# EAGLE design FY - OPTO_BOARD_1_SWBOTTOP (EAGLE 6.0)
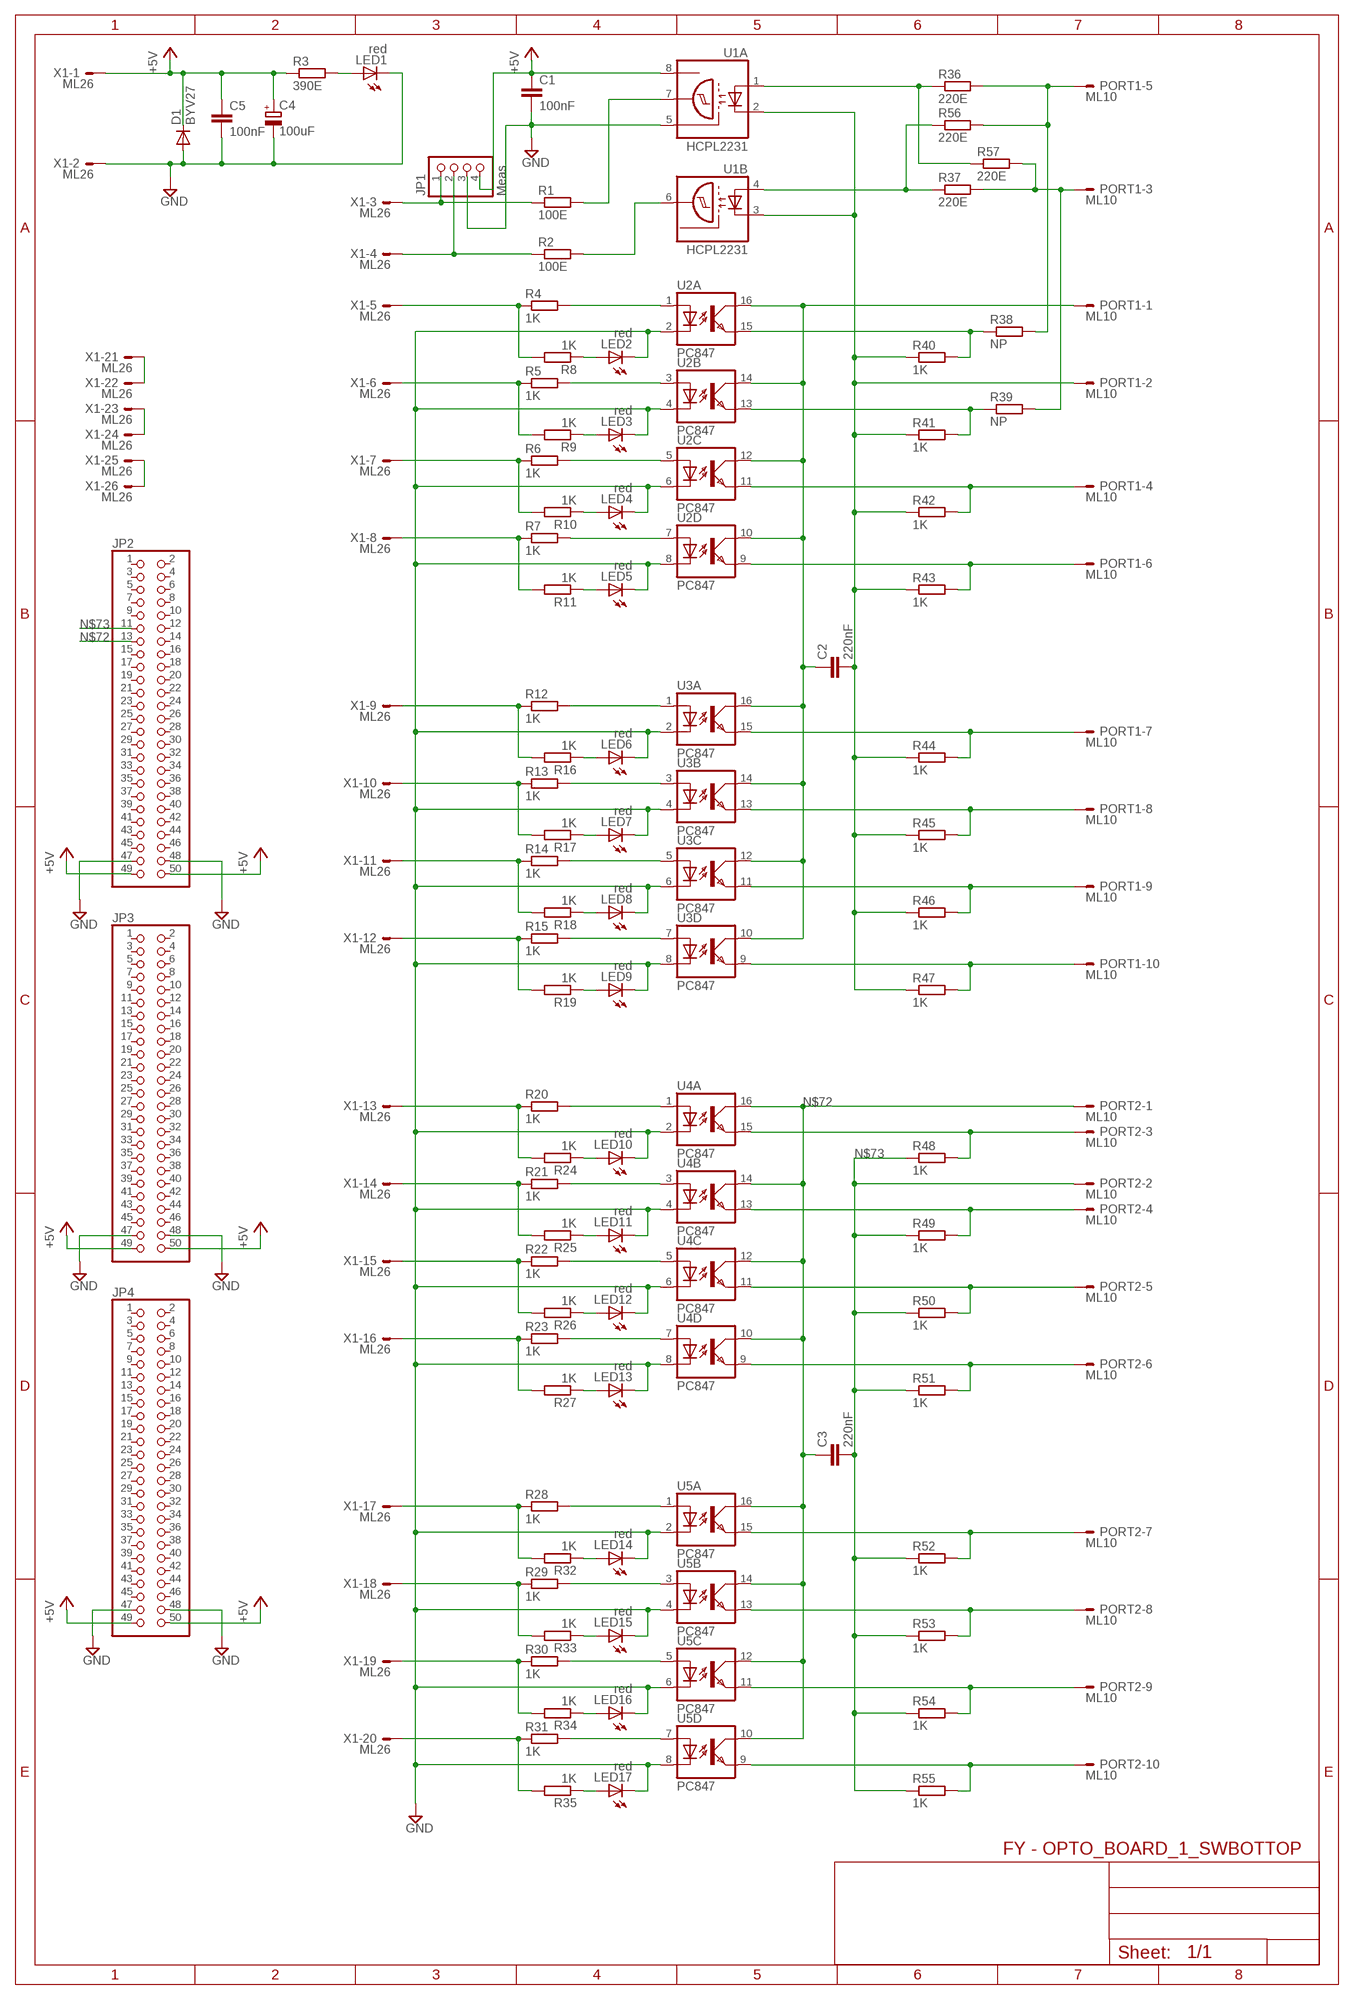
[diagram p0: schematic, sheet 1]

## Parts
C1  100nF  C-EU050-025X075  [C050-025X075]
C2  220nF  C-EU050-025X075  [C050-025X075]
C3  220nF  C-EU050-025X075  [C050-025X075]
C4  100uF  CPOL-EUE5-8.5  [E5-8,5]
C5  100nF  C-EU050-025X075  [C050-025X075]
D1  BYV27  [SOD57-10]
JP1  Meas  PINHD-1X4  [1X04]
JP2  PINHD-2X25  [2X25]
JP3  PINHD-2X25  [2X25]
JP4  PINHD-2X25  [2X25]
LED1  red  LED3MM  [LED3MM]
LED2  red  LED3MM  [LED3MM]
LED3  red  LED3MM  [LED3MM]
LED4  red  LED3MM  [LED3MM]
LED5  red  LED3MM  [LED3MM]
LED6  red  LED3MM  [LED3MM]
LED7  red  LED3MM  [LED3MM]
LED8  red  LED3MM  [LED3MM]
LED9  red  LED3MM  [LED3MM]
LED10  red  LED3MM  [LED3MM]
LED11  red  LED3MM  [LED3MM]
LED12  red  LED3MM  [LED3MM]
LED13  red  LED3MM  [LED3MM]
LED14  red  LED3MM  [LED3MM]
LED15  red  LED3MM  [LED3MM]
LED16  red  LED3MM  [LED3MM]
LED17  red  LED3MM  [LED3MM]
PORT1  ML10  ML10E  [ML10]
PORT2  ML10  ML10E  [ML10]
R1  100E  R-EU_0207/10  [0207/10]
R2  100E  R-EU_0207/10  [0207/10]
R3  390E  R-EU_0207/10  [0207/10]
R4  1K  R-EU_0207/10  [0207/10]
R5  1K  R-EU_0207/10  [0207/10]
R6  1K  R-EU_0207/10  [0207/10]
R7  1K  R-EU_0207/10  [0207/10]
R8  1K  R-EU_0207/10  [0207/10]
R9  1K  R-EU_0207/10  [0207/10]
R10  1K  R-EU_0207/10  [0207/10]
R11  1K  R-EU_0207/10  [0207/10]
R12  1K  R-EU_0207/10  [0207/10]
R13  1K  R-EU_0207/10  [0207/10]
R14  1K  R-EU_0207/10  [0207/10]
R15  1K  R-EU_0207/10  [0207/10]
R16  1K  R-EU_0207/10  [0207/10]
R17  1K  R-EU_0207/10  [0207/10]
R18  1K  R-EU_0207/10  [0207/10]
R19  1K  R-EU_0207/10  [0207/10]
R20  1K  R-EU_0207/10  [0207/10]
R21  1K  R-EU_0207/10  [0207/10]
R22  1K  R-EU_0207/10  [0207/10]
R23  1K  R-EU_0207/10  [0207/10]
R24  1K  R-EU_0207/10  [0207/10]
R25  1K  R-EU_0207/10  [0207/10]
R26  1K  R-EU_0207/10  [0207/10]
R27  1K  R-EU_0207/10  [0207/10]
R28  1K  R-EU_0207/10  [0207/10]
R29  1K  R-EU_0207/10  [0207/10]
R30  1K  R-EU_0207/10  [0207/10]
R31  1K  R-EU_0207/10  [0207/10]
R32  1K  R-EU_0207/10  [0207/10]
R33  1K  R-EU_0207/10  [0207/10]
R34  1K  R-EU_0207/10  [0207/10]
R35  1K  R-EU_0207/10  [0207/10]
R36  220E  R-EU_0207/10  [0207/10]
R37  220E  R-EU_0207/10  [0207/10]
R38  NP  R-EU_0207/10  [0207/10]
R39  NP  R-EU_0207/10  [0207/10]
R40  1K  R-EU_0207/10  [0207/10]
R41  1K  R-EU_0207/10  [0207/10]
R42  1K  R-EU_0207/10  [0207/10]
R43  1K  R-EU_0207/10  [0207/10]
R44  1K  R-EU_0207/10  [0207/10]
R45  1K  R-EU_0207/10  [0207/10]
R46  1K  R-EU_0207/10  [0207/10]
R47  1K  R-EU_0207/10  [0207/10]
R48  1K  R-EU_0207/10  [0207/10]
R49  1K  R-EU_0207/10  [0207/10]
R50  1K  R-EU_0207/10  [0207/10]
R51  1K  R-EU_0207/10  [0207/10]
R52  1K  R-EU_0207/10  [0207/10]
R53  1K  R-EU_0207/10  [0207/10]
R54  1K  R-EU_0207/10  [0207/10]
R55  1K  R-EU_0207/10  [0207/10]
R56  220E  R-EU_0207/10  [0207/10]
R57  220E  R-EU_0207/10  [0207/10]
U1  HCPL2231  [DIL08]
U2  PC847  [DIL16]
U3  PC847  [DIL16]
U4  PC847  [DIL16]
U5  PC847  [DIL16]
X1  ML26  ML26E  [ML26]

## Nets
+5V [Power]: C1.1 C4.+ C5.1 D1.C JP1.4 JP2.49 JP2.50 JP3.49 JP3.50 JP4.49 JP4.50 R3.1 U1.8(A:VCC) X1.1
GND [Power]: C1.2 C4.- C5.2 D1.A JP1.3 JP2.47 JP2.48 JP3.47 JP3.48 JP4.47 JP4.48 LED1.K(C) LED2.K(C) LED3.K(C) LED4.K(C) LED5.K(C) LED6.K(C) LED7.K(C) LED8.K(C) LED9.K(C) LED10.K(C) LED11.K(C) LED12.K(C) LED13.K(C) LED14.K(C) LED15.K(C) LED16.K(C) LED17.K(C) U1.5(A:GND) U2.2(A:C) U2.4(B:C) U2.6(C:C) U2.8(D:C) U3.2(A:C) U3.4(B:C) U3.6(C:C) U3.8(D:C) U4.2(A:C) U4.4(B:C) U4.6(C:C) U4.8(D:C) U5.2(A:C) U5.4(B:C) U5.6(C:C) U5.8(D:C) X1.2
N$1: R1.2 U1.7(A:OUT)
N$2: LED1.A R3.2
N$3: R2.2 U1.6(B:OUT)
N$4: JP1.1 R1.1 X1.3
N$5: JP1.2 R2.1 X1.4
N$6: R4.2 U2.1(A:A)
N$7: R5.2 U2.3(B:A)
N$8: R6.2 U2.5(C:A)
N$9: R7.2 U2.7(D:A)
N$10: R4.1 R8.2 X1.5
N$11: LED2.A R8.1
N$12: LED3.A R9.1
N$13: LED4.A R10.1
N$14: LED5.A R11.1
N$15: R5.1 R9.2 X1.6
N$16: R6.1 R10.2 X1.7
N$17: R7.1 R11.2 X1.8
N$18: PORT1.6 R43.2 U2.9(D:EMIT)
N$19: PORT1.4 R42.2 U2.11(C:EMIT)
N$20: R39.1 R41.2 U2.13(B:EMIT)
N$21: R38.1 R40.2 U2.15(A:EMIT)
N$22: R12.2 U3.1(A:A)
N$23: R12.1 R16.2 X1.9
N$24 [Power]: C2.1 PORT1.1 U2.10(D:COL) U2.12(C:COL) U2.14(B:COL) U2.16(A:COL) U3.10(D:COL) U3.12(C:COL) U3.14(B:COL) U3.16(A:COL)
N$25: R13.2 U3.3(B:A)
N$26: R13.1 R17.2 X1.10
N$27: PORT1.3 R37.2 R39.2 R57.2
N$28: R14.2 U3.5(C:A)
N$29: R14.1 R18.2 X1.11
N$30: PORT1.7 R44.2 U3.15(A:EMIT)
N$31: R15.2 U3.7(D:A)
N$32: R15.1 R19.2 X1.12
N$33: R36.1 R57.1 U1.1(A:A)
N$34: LED6.A R16.1
N$35: LED7.A R17.1
N$36: LED8.A R18.1
N$37: LED9.A R19.1
N$38: R20.2 U4.1(A:A)
N$39: R20.1 R24.2 X1.13
N$40: R37.1 R56.1 U1.4(B:A)
N$41: LED10.A R24.1
N$42: R21.2 U4.3(B:A)
N$43: R21.1 R25.2 X1.14
N$44: PORT1.5 R36.2 R38.2 R56.2
N$45: R22.2 U4.5(C:A)
N$46: R22.1 R26.2 X1.15
N$47: PORT1.8 R45.2 U3.13(B:EMIT)
N$48: R23.2 U4.7(D:A)
N$49: R23.1 R27.2 X1.16
N$50: PORT1.9 R46.2 U3.11(C:EMIT)
N$51: LED13.A R27.1
N$52: LED12.A R26.1
N$53: LED11.A R25.1
N$54: R28.2 U5.1(A:A)
N$55: R28.1 R32.2 X1.17
N$56: PORT1.10 R47.2 U3.9(D:EMIT)
N$57: R29.2 U5.3(B:A)
N$58: R29.1 R33.2 X1.18
N$59 [Power]: C2.2 PORT1.2 R40.1 R41.1 R42.1 R43.1 R44.1 R45.1 R46.1 R47.1 U1.2(A:C) U1.3(B:C)
N$60: R30.2 U5.5(C:A)
N$61: R30.1 R34.2 X1.19
N$62: R31.2 U5.7(D:A)
N$63: R31.1 R35.2 X1.20
N$64: PORT2.3 R48.2 U4.15(A:EMIT)
N$65: LED14.A R32.1
N$66: LED15.A R33.1
N$67: LED16.A R34.1
N$68: PORT2.4 R49.2 U4.13(B:EMIT)
N$69: LED17.A R35.1
N$70: PORT2.5 R50.2 U4.11(C:EMIT)
N$71: PORT2.6 R51.2 U4.9(D:EMIT)
N$72 [Power]: C3.1 JP2.13 PORT2.1 U4.10(D:COL) U4.12(C:COL) U4.14(B:COL) U4.16(A:COL) U5.10(D:COL) U5.12(C:COL) U5.14(B:COL) U5.16(A:COL)
N$73 [Power]: C3.2 JP2.11 PORT2.2 R48.1 R49.1 R50.1 R51.1 R52.1 R53.1 R54.1 R55.1
N$74: PORT2.7 R52.2 U5.15(A:EMIT)
N$75: PORT2.8 R53.2 U5.13(B:EMIT)
N$76: PORT2.9 R54.2 U5.11(C:EMIT)
N$77: PORT2.10 R55.2 U5.9(D:EMIT)
N$78: X1.21 X1.22
N$79: X1.25 X1.26
N$155: X1.23 X1.24
Unconnected: JP2.1 JP2.2 JP2.3 JP2.4 JP2.5 JP2.6 JP2.7 JP2.8 JP2.9 JP2.10 JP2.12 JP2.14 JP2.15 JP2.16 JP2.17 JP2.18 JP2.19 JP2.20 JP2.21 JP2.22 JP2.23 JP2.24 JP2.25 JP2.26 JP2.27 JP2.28 JP2.29 JP2.30 JP2.31 JP2.32 JP2.33 JP2.34 JP2.35 JP2.36 JP2.37 JP2.38 JP2.39 JP2.40 JP2.41 JP2.42 JP2.43 JP2.44 JP2.45 JP2.46 JP3.1 JP3.2 JP3.3 JP3.4 JP3.5 JP3.6 JP3.7 JP3.8 JP3.9 JP3.10 JP3.11 JP3.12 JP3.13 JP3.14 JP3.15 JP3.16 JP3.17 JP3.18 JP3.19 JP3.20 JP3.21 JP3.22 JP3.23 JP3.24 JP3.25 JP3.26 JP3.27 JP3.28 JP3.29 JP3.30 JP3.31 JP3.32 JP3.33 JP3.34 JP3.35 JP3.36 JP3.37 JP3.38 JP3.39 JP3.40 JP3.41 JP3.42 JP3.43 JP3.44 JP3.45 JP3.46 JP4.1 JP4.2 JP4.3 JP4.4 JP4.5 JP4.6 JP4.7 JP4.8 JP4.9 JP4.10 JP4.11 JP4.12 JP4.13 JP4.14 JP4.15 JP4.16 JP4.17 JP4.18 JP4.19 JP4.20 JP4.21 JP4.22 JP4.23 JP4.24 JP4.25 JP4.26 JP4.27 JP4.28 JP4.29 JP4.30 JP4.31 JP4.32 JP4.33 JP4.34 JP4.35 JP4.36 JP4.37 JP4.38 JP4.39 JP4.40 JP4.41 JP4.42 JP4.43 JP4.44 JP4.45 JP4.46

## Library data of the parts
C1-C3 C5 = rcl:C-EU: CAPACITOR, European symbol
C4 = rcl:CPOL-EU: POLARIZED CAPACITOR, European symbol
D1 = diode:BYV27: DIODE ultra fast
JP1 = pinhead:PINHD-1X4: PIN HEADER
JP2-JP4 = pinhead:PINHD-2X25: PIN HEADER
LED1-LED17 = led:LED: LED OSRAM: - CHIPLED LG R971, LG N971, LY N971, LG Q971, LY Q971, LO R971, LY R971 LH N974, LH R974 LS Q976, LO Q976, LY Q976 LO Q996 - Hyper CHIPLED LW Q18S LB Q993, LB Q99A, LB R99A - SideLED LS A670, LO A670, LY A670, LG A670, LP A670 LB A673, LV A673, LT A673, LW A673 LH A674 LY A675 LS A676, LA A676, LO A676, LY A676, LW A676 LS A679, LY A679, LG A679 - Hyper Micro SIDELED® LS Y876, LA Y876, LO Y876, LY Y876 LT Y87S - SmartLED LW L88C, LW L88S LB L89C, LB L89S, LG L890 LS L89K, LO L89K, LY L89K LS L896, LA L896, LO L896, LY L896 - TOPLED LS T670, LO T670, LY T670, LG T670, LP T670 LSG T670, LSP T670, LSY T670, LOP T670, LYG T670 LG T671, LOG T671, LSG T671 LB T673, LV T673, LT T673, LW T673 LH T674 LS T676, LA T676, LO T676, LY T676, LB T676, LH T676, LSB T676, LW T676 LB T67C, LV T67C, LT T67C, LS T67K, LO T67K, LY T67K, LW E67C LS E67B, LA E67B, LO E67B, LY E67B, LB E67C, LV E67C, LT E67C LW T67C LS T679, LY T679, LG T679 LS T770, LO T770, LY T770, LG T770, LP T770 LB T773, LV T773, LT T773, LW T773 LH T774 LS E675, LA E675, LY E675, LS T675 LS T776, LA T776, LO T776, LY T776, LB T776 LHGB T686 LT T68C, LB T68C - Hyper Mini TOPLED® LB M676 - Mini TOPLED Santana® LG M470 LS M47K, LO M47K, LY M47K Source: http://www.osram.convergy.de LUXEON: - LUMILED® LXK2-PW12-R00, LXK2-PW12-S00, LXK2-PW14-U00, LXK2-PW14-V00 LXK2-PM12-R00, LXK2-PM12-S00, LXK2-PM14-U00 LXK2-PE12-Q00, LXK2-PE12-R00, LXK2-PE12-S00, LXK2-PE14-T00, LXK2-PE14-U00 LXK2-PB12-K00, LXK2-PB12-L00, LXK2-PB12-M00, LXK2-PB14-N00, LXK2-PB14-P00, LXK2-PB14-Q00 LXK2-PR12-L00, LXK2-PR12-M00, LXK2-PR14-Q00, LXK2-PR14-R00 LXK2-PD12-Q00, LXK2-PD12-R00, LXK2-PD12-S00 LXK2-PH12-R00, LXK2-PH12-S00 LXK2-PL12-P00, LXK2-PL12-Q00, LXK2-PL12-R00 Source: www.luxeon.com KINGBRIGHT: KA-3528ASYC Source: www.kingbright.com
PORT1 PORT2 = con-harting-ml:ML10?E: HARTING; OC_FARNELL: unknown; OC_NEWARK: unknown
R1-R57 = rcl:R-EU_: RESISTOR, European symbol
U1 = optocoupler:HCPL2231: HEWLETT PACKARD OPTO COUPLER; MF: AGILENT TECHNOLOGIES; MPN: HCPL-2231-000E; OC_FARNELL: 9994955; OC_NEWARK: 88H7801
U2-U5 = optocoupler:PC847: SHARP OPTO COUPLER; OC_FARNELL: 9707735; OC_NEWARK: unknown
X1 = con-harting-ml:ML26?E: HARTING; OC_FARNELL: unknown; OC_NEWARK: unknown

## Net classes
0 default: width 0.305 mm, clearance 0.305 mm
1 Power: width 0.61 mm, clearance 0.61 mm

## Board
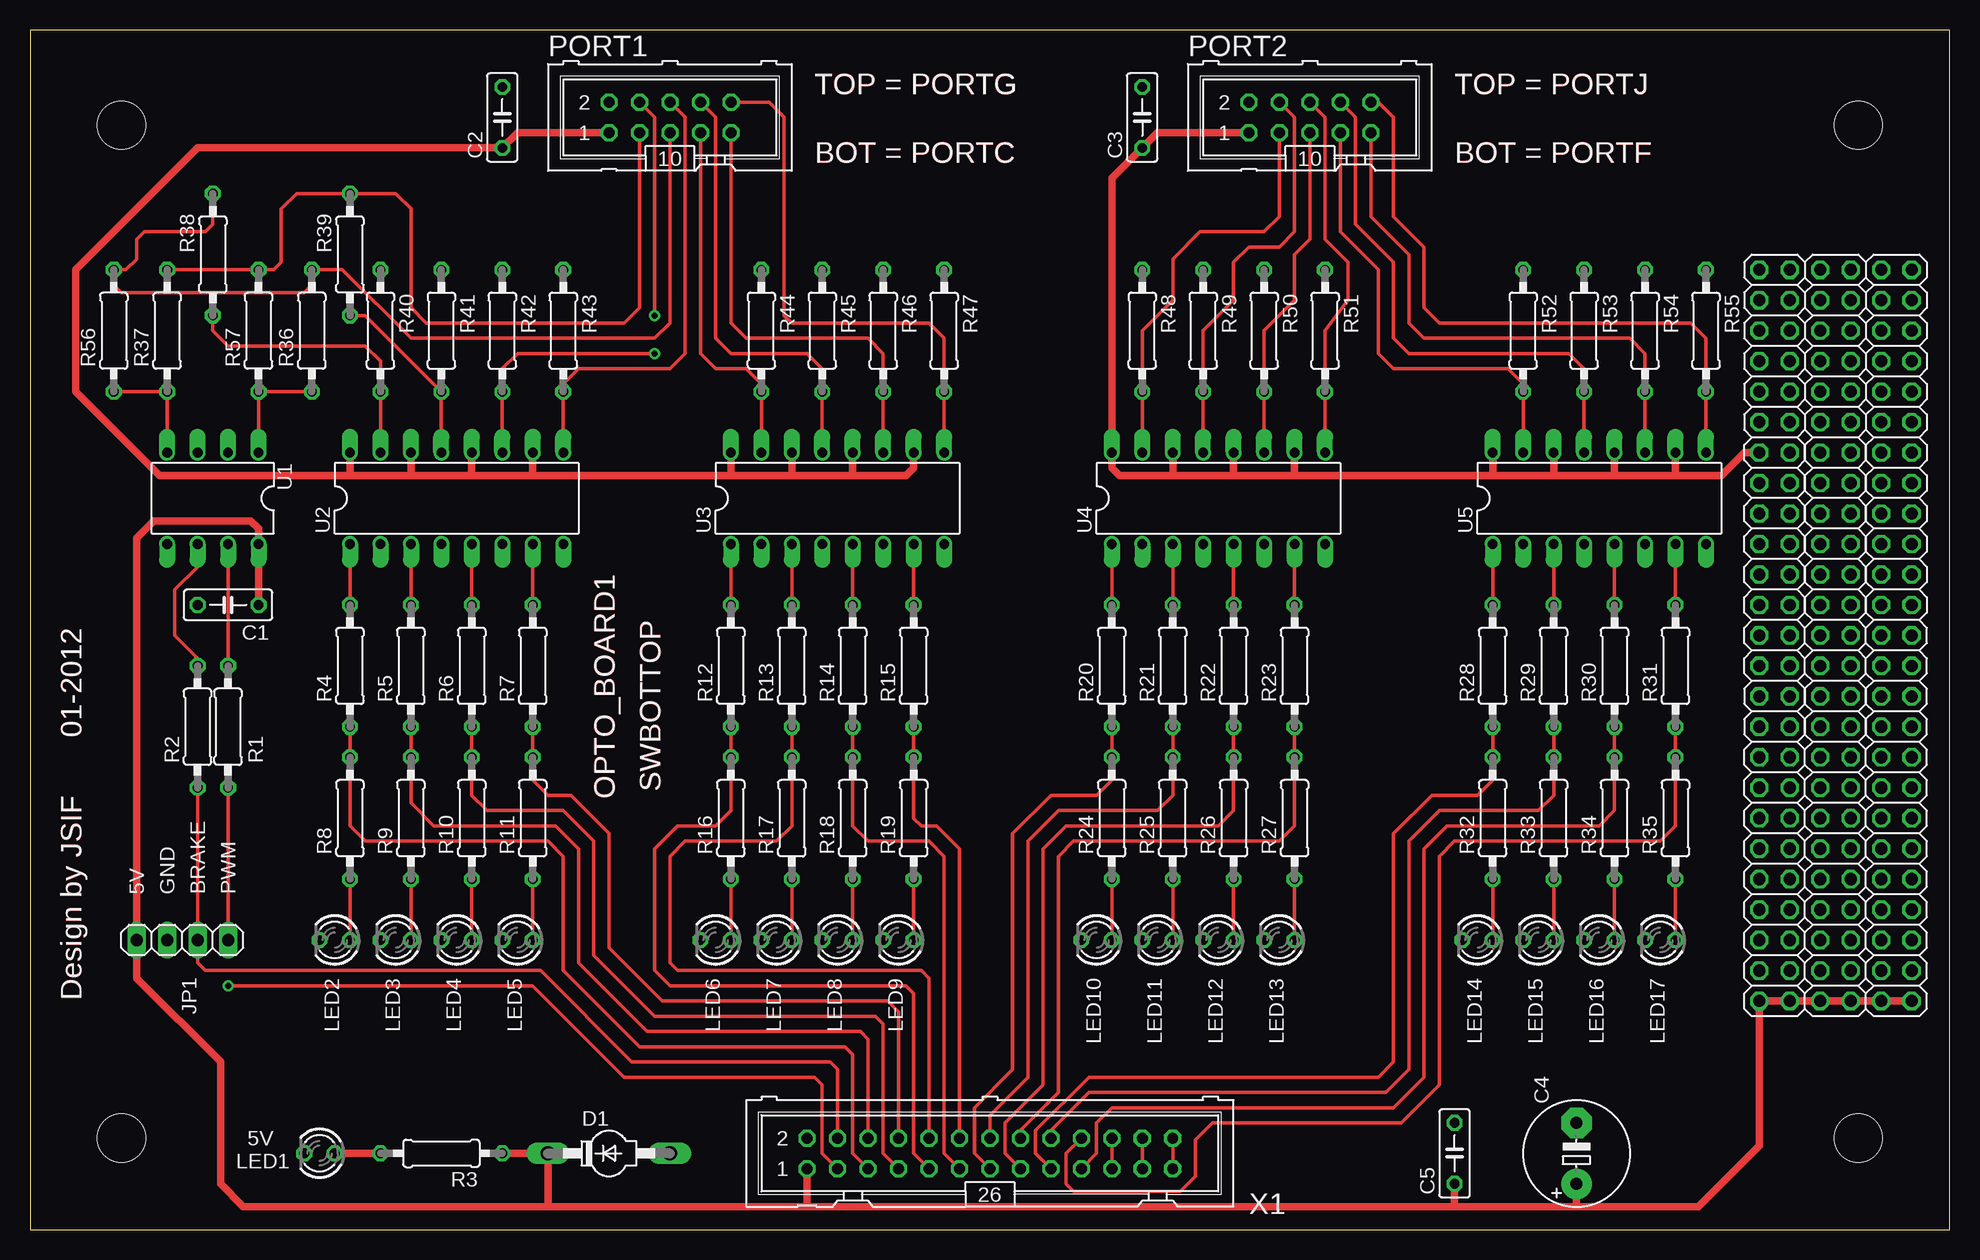
[diagram p1: board, top side]
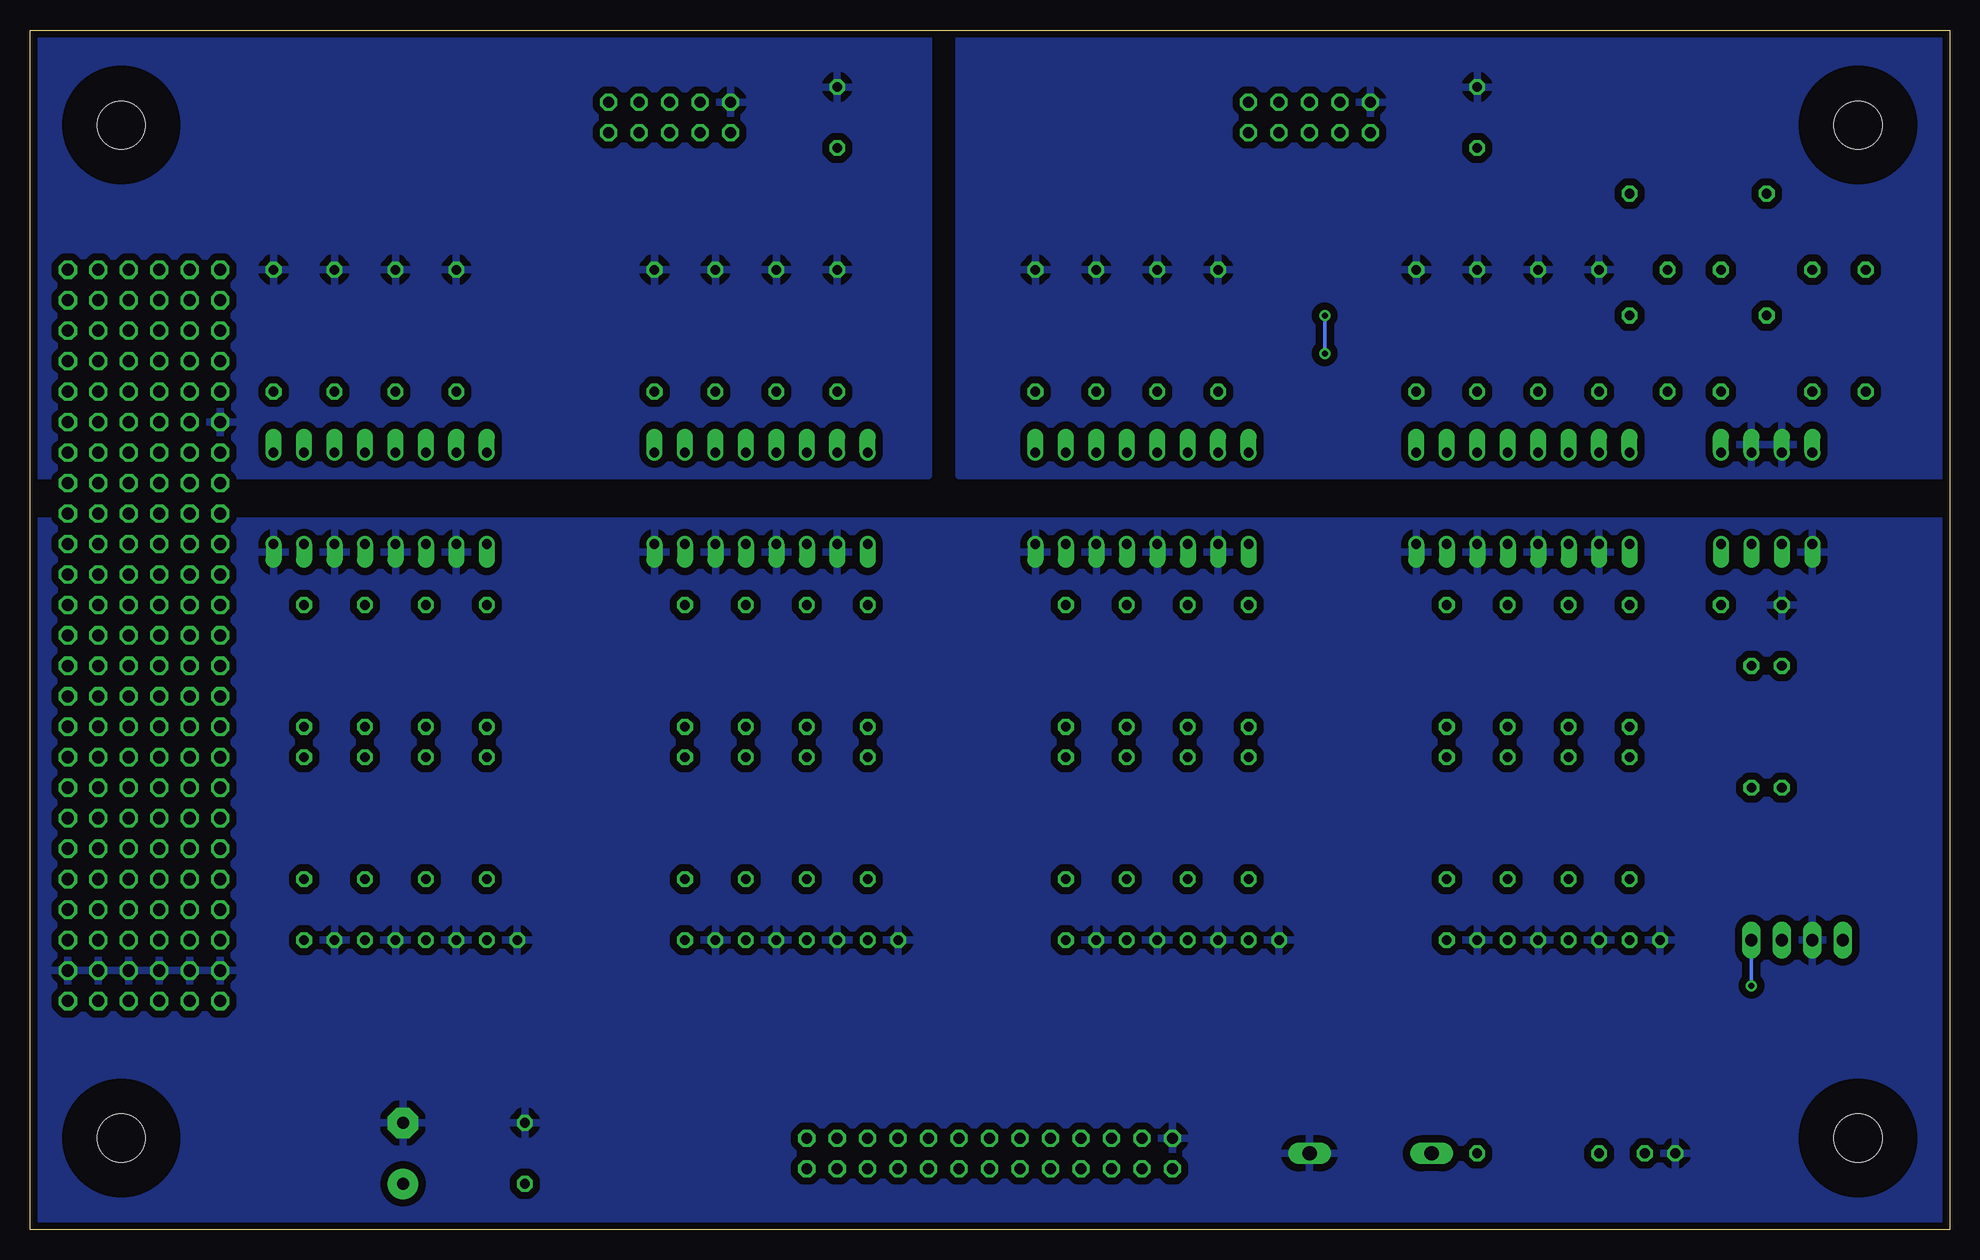
[diagram p2: board, bottom side, seen from below]

Size 160 x 100 mm. Coordinates in mm from the lower left corner, seen from the top.
Outline: 0,0 160,0 160,100 0,100 0,0
Copper layers (1*16): Top 0.035mm / dielectric 1.5mm / Bottom 0.035mm
Design rules: minimum track width 12mil, minimum drill 12mil, track to track 8mil, track to pad 8mil, pad to pad 8mil, via to via 8mil, smd to smd 8mil, copper to edge 24mil, drill to drill 24mil, minimum pad ring 10mil, minimum via ring 8mil, stop-mask expansion 4mil, vias tented up to drill 0mil, thermal gap 24mil
Holes 4 mm at 7.62,7.62 7.62,92.08 152.4,92.08 152.4,7.62
bRestrict: area 3.6,88.1 to 11.6,96.1; area 3.6,3.6 to 11.6,11.6; area 148.4,3.6 to 156.4,11.6; area 148.4,88.1 to 156.4,96.1

### Footprints (pad centres in the part's own frame; a part is rotated, then mirrored left to right if it is on the bottom)
C050-025X075 = drill 0.813 octagon: 1 -2.54,0; 2 2.54,0
E5-8,5 = drill 1.016 pad 2.54: + -2.54,0 | drill 1.016 pad 2.54 octagon: - 2.54,0
SOD57-10 = drill 1.194 long: A 5.08,0; C -5.08,0
1X04 = drill 1.016 long: 1 -3.81,0; 2 -1.27,0; 3 1.27,0; 4 3.81,0
2X25 = drill 1.016 octagon: 1 -30.48,-1.27; 2 -30.48,1.27; 3 -27.94,-1.27; 4 -27.94,1.27; 5 -25.4,-1.27; 6 -25.4,1.27; 7 -22.86,-1.27; 8 -22.86,1.27; 9 -20.32,-1.27; 10 -20.32,1.27; 11 -17.78,-1.27; 12 -17.78,1.27; 13 -15.24,-1.27; 14 -15.24,1.27; 15 -12.7,-1.27; 16 -12.7,1.27; 17 -10.16,-1.27; 18 -10.16,1.27; 19 -7.62,-1.27; 20 -7.62,1.27; 21 -5.08,-1.27; 22 -5.08,1.27; 23 -2.54,-1.27; 24 -2.54,1.27; 25 0,-1.27; 26 0,1.27; 27 2.54,-1.27; 28 2.54,1.27; 29 5.08,-1.27; 30 5.08,1.27; 31 7.62,-1.27; 32 7.62,1.27; 33 10.16,-1.27; 34 10.16,1.27; 35 12.7,-1.27; 36 12.7,1.27; 37 15.24,-1.27; 38 15.24,1.27; 39 17.78,-1.27; 40 17.78,1.27; 41 20.32,-1.27; 42 20.32,1.27; 43 22.86,-1.27; 44 22.86,1.27; 45 25.4,-1.27; 46 25.4,1.27; 47 27.94,-1.27; 48 27.94,1.27; 49 30.48,-1.27; 50 30.48,1.27
LED3MM = drill 0.813 octagon: A -1.27,0; K 1.27,0
ML10 = drill 0.914 octagon: 1 -5.08,-1.27; 2 -5.08,1.27; 3 -2.54,-1.27; 4 -2.54,1.27; 5 0,-1.27; 6 0,1.27; 7 2.54,-1.27; 8 2.54,1.27; 9 5.08,-1.27; 10 5.08,1.27
0207/10 = drill 0.813 octagon: 1 -5.08,0; 2 5.08,0
DIL08 = drill 0.813 offset: 1 -3.81,-3.81; 2 -1.27,-3.81; 3 1.27,-3.81; 4 3.81,-3.81; 5 3.81,3.81; 6 1.27,3.81; 7 -1.27,3.81; 8 -3.81,3.81
DIL16 = drill 0.813 offset: 1 -8.89,-3.81; 2 -6.35,-3.81; 3 -3.81,-3.81; 4 -1.27,-3.81; 5 1.27,-3.81; 6 3.81,-3.81; 7 6.35,-3.81; 8 8.89,-3.81; 9 8.89,3.81; 10 6.35,3.81; 11 3.81,3.81; 12 1.27,3.81; 13 -1.27,3.81; 14 -3.81,3.81; 15 -6.35,3.81; 16 -8.89,3.81
ML26 = drill 0.914 octagon: 1 -15.24,-1.27; 2 -15.24,1.27; 3 -12.7,-1.27; 4 -12.7,1.27; 5 -10.16,-1.27; 6 -10.16,1.27; 7 -7.62,-1.27; 8 -7.62,1.27; 9 -5.08,-1.27; 10 -5.08,1.27; 11 -2.54,-1.27; 12 -2.54,1.27; 13 0,-1.27; 14 0,1.27; 15 2.54,-1.27; 16 2.54,1.27; 17 5.08,-1.27; 18 5.08,1.27; 19 7.62,-1.27; 20 7.62,1.27; 21 10.16,-1.27; 22 10.16,1.27; 23 12.7,-1.27; 24 12.7,1.27; 25 15.24,-1.27; 26 15.24,1.27

### Placement (x,y rotation side)
C1  16.51,52.07 180 top
C2  39.37,92.71 90 top
C3  92.71,92.71 90 top
C4  128.91,6.35 90 top
C5  118.75,6.35 90 top
D1  48.26,6.35 0 top
JP1  12.7,24.13 180 top
JP2  145.41,49.53 270 top
JP3  150.5,49.53 270 top
JP4  155.57,49.53 270 top
LED1  24.13,6.35 180 top
LED2  25.4,24.13 180 top
LED3  30.48,24.13 180 top
LED4  35.56,24.13 180 top
LED5  40.64,24.13 180 top
LED6  57.15,24.13 180 top
LED7  62.23,24.13 180 top
LED8  67.31,24.13 180 top
LED9  72.39,24.13 180 top
LED10  88.9,24.13 180 top
LED11  93.98,24.13 180 top
LED12  99.06,24.13 180 top
LED13  104.14,24.13 180 top
LED14  120.65,24.13 180 top
LED15  125.73,24.13 180 top
LED16  130.81,24.13 180 top
LED17  135.89,24.13 180 top
PORT1  53.34,92.71 0 top
PORT2  106.68,92.71 0 top
R1  16.51,41.91 90 top
R2  13.97,41.91 90 top
R3  34.29,6.35 180 top
R4  26.67,46.99 90 top
R5  31.75,46.99 90 top
R6  36.83,46.99 90 top
R7  41.91,46.99 90 top
R8  26.67,34.29 90 top
R9  31.75,34.29 90 top
R10  36.83,34.29 90 top
R11  41.91,34.29 90 top
R12  58.42,46.99 90 top
R13  63.5,46.99 90 top
R14  68.58,46.99 90 top
R15  73.66,46.99 90 top
R16  58.42,34.29 90 top
R17  63.5,34.29 90 top
R18  68.58,34.29 90 top
R19  73.66,34.29 90 top
R20  90.17,46.99 90 top
R21  95.25,46.99 90 top
R22  100.33,46.99 90 top
R23  105.41,46.99 90 top
R24  90.17,34.29 90 top
R25  95.25,34.29 90 top
R26  100.33,34.29 90 top
R27  105.41,34.29 90 top
R28  121.92,46.99 90 top
R29  127,46.99 90 top
R30  132.08,46.99 90 top
R31  137.16,46.99 90 top
R32  121.92,34.29 90 top
R33  127,34.29 90 top
R34  132.08,34.29 90 top
R35  137.16,34.29 90 top
R36  23.5,74.93 90 top
R37  11.43,74.93 90 top
R38  15.24,81.28 90 top
R39  26.67,81.28 90 top
R40  29.21,74.93 270 top
R41  34.29,74.93 270 top
R42  39.37,74.93 270 top
R43  44.45,74.93 270 top
R44  60.96,74.93 270 top
R45  66.04,74.93 270 top
R46  71.12,74.93 270 top
R47  76.2,74.93 270 top
R48  92.71,74.93 270 top
R49  97.79,74.93 270 top
R50  102.87,74.93 270 top
R51  107.95,74.93 270 top
R52  124.46,74.93 270 top
R53  129.54,74.93 270 top
R54  134.62,74.93 270 top
R55  139.7,74.93 270 top
R56  6.99,74.93 90 top
R57  19.05,74.93 90 top
U1  15.24,60.96 180 top
U2  35.56,60.96 0 top
U3  67.31,60.96 0 top
U4  99.06,60.96 0 top
U5  130.81,60.96 0 top
X1  80.01,6.35 0 top

### Tracks (layer width: path | path; a pad name or v marks a point on that pad's centre or on a via)
+5V
  Top 0.61: R3.1 D1.C 43.18,1.91 | 43.18,1.91 17.78,1.91 15.88,3.81 15.88,13.97 8.89,20.95 JP1.4 8.89,57.63 10.31,59.05 18.41,59.05 19.05,58.42 U1.8 C1.1 | 128.91,1.91 139.06,1.91 144.15,6.99 JP2.49 JP2.50 JP3.49 JP3.50 JP4.49 JP4.50 | 128.91,1.91 118.75,1.91 | 118.75,1.91 64.77,1.91 | 43.18,1.91 64.77,1.91 | 64.77,1.91 X1.1 | C5.1 118.75,1.91 | C4.+ 128.91,1.91
GND
  pour Bottom (isolate 0.61): 0.64,0.64 0.64,59.05 159.38,59.05 159.38,0.64
N$1
  Top 0.305: U1.7 R1.2
N$2
  Top 0.61: R3.2 LED1.A
N$3
  Top 0.305: R2.2 13.97,47.62 12.06,49.53 12.06,53.34 13.97,55.24 U1.6
N$4  (via drill 0.5)
  Top 0.305: R1.1 JP1.1 | X1.3 66.04,6.35 66.04,12.06 65.41,12.7 49.53,12.7 41.91,20.32 v16.51,20.32
  Bottom 0.305: v16.51,20.32 JP1.1
N$5
  Top 0.305: R2.1 JP1.2 13.97,22.23 14.61,21.59 42.55,21.59 50.16,13.97 66.67,13.97 67.31,13.34 X1.4
N$6
  Top 0.305: U2.1 R4.2
N$7
  Top 0.305: U2.3 R5.2
N$8
  Top 0.305: U2.5 R6.2
N$9
  Top 0.305: U2.7 R7.2
N$10
  Top 0.305: R4.1 R8.2 26.67,33.66 27.94,32.38 43.18,32.38 44.45,31.11 44.45,21.59 50.8,15.24 67.94,15.24 68.58,14.61 68.58,6.35 X1.5
N$11
  Top 0.305: R8.1 LED2.A
N$12
  Top 0.305: R9.1 LED3.A
N$13
  Top 0.305: R10.1 LED4.A
N$14
  Top 0.305: R11.1 LED5.A
N$15
  Top 0.305: R5.1 R9.2 31.75,35.56 33.66,33.66 43.81,33.66 45.72,31.75 45.72,22.23 51.44,16.51 69.22,16.51 69.85,15.88 X1.6
N$16
  Top 0.305: R6.1 R10.2 36.83,36.2 38.1,34.92 44.45,34.92 46.99,32.38 46.99,22.86 52.07,17.78 70.48,17.78 71.12,17.14 71.12,6.35 X1.7
N$17
  Top 0.305: R7.1 R11.2 41.91,37.47 43.18,36.2 45.09,36.2 48.26,33.02 48.26,23.5 52.7,19.05 71.49,19.05 72.39,18.15 X1.8
N$18
  Top 0.305: U2.9 R43.2 44.45,70.48 45.72,71.75 53.34,71.75 54.61,73.03 54.61,92.71 PORT1.6
N$19  (via drill 0.5)
  Top 0.305: U2.11 R42.2 39.37,71.75 40.64,73.03 v52.07,73.03 | PORT1.4 52.07,92.71 v52.07,76.2
  Bottom 0.305: v52.07,76.2 v52.07,73.03
N$20
  Top 0.305: U2.13 R41.2 27.94,76.2 R39.1
N$21
  Top 0.305: U2.15 R40.2 29.21,72.39 27.94,73.66 16.51,73.66 15.24,74.93 R38.1
N$22
  Top 0.305: U3.1 R12.2
N$23
  Top 0.305: R12.1 R16.2 58.42,34.92 57.15,33.66 53.98,33.66 52.07,31.75 52.07,21.59 53.34,20.32 73.03,20.32 73.66,19.68 73.66,6.35 X1.9
N$24
  Top 0.61: U2.10 41.91,62.87 | 41.91,62.87 58.42,62.87 | 58.42,62.87 U3.16 | U3.14 63.5,62.87 | 63.5,62.87 58.42,62.87 | U3.12 68.58,62.87 | 68.58,62.87 63.5,62.87 | U3.10 73.66,63.5 73.03,62.87 68.58,62.87 | U2.12 36.83,62.87 | 36.83,62.87 41.91,62.87 | U2.14 31.75,62.87 | 31.75,62.87 36.83,62.87 | U2.16 26.67,62.87 | 26.67,62.87 31.75,62.87 | 26.67,62.87 10.79,62.87 3.81,69.85 3.81,80.01 13.97,90.17 C2.1 40.64,91.44 PORT1.1
N$25
  Top 0.305: U3.3 R13.2
N$26
  Top 0.305: R13.1 R17.2 63.5,33.66 62.23,32.38 54.61,32.38 53.34,31.11 53.34,22.23 53.98,21.59 74.3,21.59 74.93,20.95 X1.10
N$27
  Top 0.305: R37.2 R57.2 20.32,80.01 20.95,80.64 20.95,85.09 22.23,86.36 R39.2 30.48,86.36 31.75,85.09 31.75,76.83 33.02,75.56 49.53,75.56 50.8,76.83 PORT1.3
N$28
  Top 0.305: U3.5 R14.2
N$29
  Top 0.305: R14.1 R18.2 68.58,33.66 69.85,32.38 74.93,32.38 76.2,31.11 76.2,6.35 X1.11
N$30
  Top 0.305: U3.15 R44.2 60.96,70.48 59.69,71.75 57.15,71.75 55.88,73.03 PORT1.7
N$31
  Top 0.305: U3.7 R15.2
N$32
  Top 0.305: R15.1 R19.2 73.66,34.29 74.3,33.66 75.56,33.66 77.47,31.75 X1.12
N$33
  Top 0.305: U1.1 R57.1 R36.1
N$34
  Top 0.305: R16.1 LED6.A
N$35
  Top 0.305: R17.1 LED7.A
N$36
  Top 0.305: R18.1 LED8.A
N$37
  Top 0.305: R19.1 LED9.A
N$38
  Top 0.305: U4.1 R20.2
N$39
  Top 0.305: R20.1 R24.2 90.17,37.47 88.9,36.2 85.09,36.2 81.92,33.02 81.92,13.34 78.74,10.16 78.74,6.35 X1.13
N$40
  Top 0.305: R56.1 R37.1 U1.4
N$41
  Top 0.305: R24.1 LED10.A
N$42
  Top 0.305: U4.3 R21.2
N$43
  Top 0.305: R21.1 R25.2 95.25,36.2 93.98,34.92 85.72,34.92 83.19,32.38 83.19,12.7 80.01,9.53 X1.14
N$44
  Top 0.305: R38.2 15.24,83.82 14.61,83.19 9.53,83.19 8.89,82.55 8.89,80.91 7.99,80.01 R56.2 6.99,78.74 7.62,78.11 22.86,78.11 23.5,78.74 R36.2 26.04,80.01 31.75,74.3 52.07,74.3 53.34,75.56 PORT1.5
N$45
  Top 0.305: U4.5 R22.2
N$46
  Top 0.305: R22.1 R26.2 100.33,34.92 99.06,33.66 86.36,33.66 84.45,31.75 84.45,12.06 81.28,8.89 81.28,6.35 X1.15
N$47
  Top 0.305: U3.13 R45.2 66.04,71.75 64.77,73.03 58.42,73.03 57.15,74.3 57.15,92.71 PORT1.8
N$48
  Top 0.305: U4.7 R23.2
N$49
  Top 0.305: R23.1 R27.2 105.41,33.66 104.14,32.38 87,32.38 85.72,31.11 85.72,11.43 82.55,8.26 X1.16
N$50
  Top 0.305: U3.11 R46.2 71.12,73.03 69.85,74.3 59.69,74.3 58.42,75.56 PORT1.9
N$51
  Top 0.305: R27.1 LED13.A
N$52
  Top 0.305: R26.1 LED12.A
N$53
  Top 0.305: R25.1 LED11.A
N$54
  Top 0.305: U5.1 R28.2
N$55
  Top 0.305: R28.1 R32.2 121.92,37.47 120.65,36.2 116.84,36.2 113.67,33.02 113.67,13.97 112.39,12.7 88.27,12.7 83.82,8.26 83.82,6.35 X1.17
N$56
  Top 0.305: U3.9 R47.2 76.2,74.3 74.93,75.56 63.5,75.56 62.87,76.2 62.87,92.71 61.59,93.98 PORT1.10
N$57
  Top 0.305: U5.3 R29.2
N$58
  Top 0.305: R29.1 R33.2 127,36.2 125.73,34.92 117.47,34.92 114.94,32.38 114.94,13.34 113.03,11.43 88.27,11.43 85.09,8.26 X1.18
N$59
  pour Bottom (isolate 0.61): 0.64,62.87 0.64,99.69 82.55,99.69 82.55,62.87
N$60
  Top 0.305: U5.5 R30.2
N$61
  Top 0.305: R30.1 R34.2 132.08,34.92 130.81,33.66 118.11,33.66 116.2,31.75 116.2,12.7 113.67,10.16 90.17,10.16 88.9,8.89 88.9,6.35 X1.19
N$62
  Top 0.305: U5.7 R31.2
N$63
  Top 0.305: R31.1 R35.2 137.16,33.66 135.89,32.38 118.75,32.38 117.47,31.11 117.47,12.06 114.3,8.89 98.58,8.89 97.16,7.47 97.16,4.45 95.89,3.17 87,3.17 86.36,3.81 86.36,6.35 X1.20
N$64
  Top 0.305: U4.15 R48.2 92.71,74.93 95.25,77.47 95.25,80.89 97.54,83.19 102.87,83.19 104.14,84.45 PORT2.3
N$65
  Top 0.305: R32.1 LED14.A
N$66
  Top 0.305: R33.1 LED15.A
N$67
  Top 0.305: R34.1 LED16.A
N$68
  Top 0.305: U4.13 R49.2 97.79,74.93 100.33,77.47 100.33,80.64 101.6,81.92 104.14,81.92 105.41,83.19 105.41,92.71 PORT2.4
N$69
  Top 0.305: R35.1 LED17.A
N$70
  Top 0.305: U4.11 R50.2 102.87,74.93 105.41,77.47 105.41,81.28 106.68,82.55 PORT2.5
N$71
  Top 0.305: U4.9 R51.2 107.95,74.93 109.86,77.47 109.86,80.64 107.95,82.55 107.95,92.71 PORT2.6
N$72
  Top 0.61: PORT2.1 93.98,91.44 C3.1 90.17,87.63 U4.16 90.17,63.5 90.81,62.87 95.25,62.87 | U4.14 95.25,62.87 | U4.12 100.33,62.87 | 100.33,62.87 95.25,62.87 | U4.10 105.41,62.87 | 105.41,62.87 100.33,62.87 | U5.16 121.92,62.87 | 121.92,62.87 105.41,62.87 | U5.14 127,62.87 | 127,62.87 121.92,62.87 | U5.12 132.08,62.87 | 132.08,62.87 127,62.87 | 137.16,62.87 132.08,62.87 | 137.16,62.87 140.97,62.87 142.88,64.77 JP2.13 | 137.16,62.87 U5.10
N$73
  pour Bottom (isolate 0.61): 159.38,62.87 85.09,62.87 85.09,99.69 159.38,99.69
N$74
  Top 0.305: U5.15 R52.2 124.46,70.48 123.19,71.75 113.67,71.75 112.39,73.03 112.39,80.01 109.22,83.19 PORT2.7
N$75
  Top 0.305: U5.13 R53.2 129.54,71.75 128.27,73.03 114.94,73.03 113.67,74.3 113.67,80.64 110.49,83.82 110.49,92.71 PORT2.8
N$76
  Top 0.305: U5.11 R54.2 134.62,73.03 133.35,74.3 116.2,74.3 114.94,75.56 114.94,81.28 111.76,84.45 PORT2.9
N$77
  Top 0.305: U5.9 R55.2 139.7,74.3 138.43,75.56 117.47,75.56 116.2,76.83 116.2,81.92 113.67,84.45 113.67,92.71 112.39,93.98 PORT2.10
N$78
  Top 0.305: X1.22 X1.21
N$79
  Top 0.305: X1.26 X1.25
N$155
  Top 0.305: X1.24 X1.23

### Text on the board
Top: TOP = PORTG | TOP = PORTJ | BOT = PORTC | BOT = PORTF | OPTO_BOARD1 | SWBOTTOP | 01-2012 | Design by JSIF
tNames: TOP = PORTG | TOP = PORTJ | BOT = PORTC | BOT = PORTF | OPTO_BOARD1 | SWBOTTOP | 01-2012 | Design by JSIF | 5V | GND | BRAKE | PWM | 5V